# EAGLE design L293D (EAGLE 6.1)
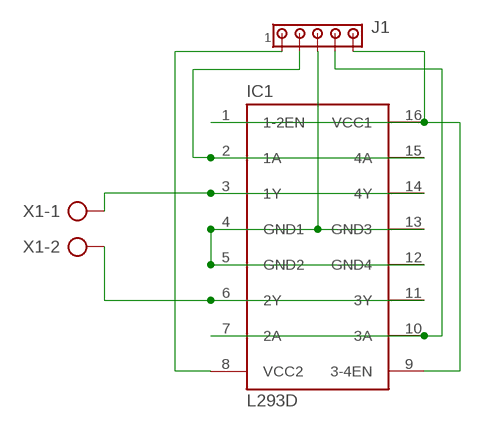
[diagram p0: schematic, sheet 1]

## Parts
IC1  L293D  [DIL16]
J1  MTA05-100  [10X05MTA]
X1  AK300/2  [AK300/2]

## Nets
N$1: IC1.1(1-2EN) IC1.9(3-4EN) IC1.16(VCC1) J1.5
N$2: IC1.2(1A) IC1.15(4A) J1.2
N$3: IC1.3(1Y) IC1.14(4Y) X1.1
N$4: IC1.4(GND1) IC1.5(GND2) IC1.12(GND4) IC1.13(GND3) J1.3
N$6: IC1.6(2Y) IC1.11(3Y) X1.2
N$7: IC1.7(2A) IC1.10(3A) J1.4
N$8: IC1.8(VCC2) J1.1

## Library data of the parts
IC1 = st-microelectronics:L293D: PUSH-PULL 4 CHANNEL DRIVER
J1 = con-amp:MTA05-100: AMP connector
X1 = con-ptr500:AK300/2: CONNECTOR

## Board
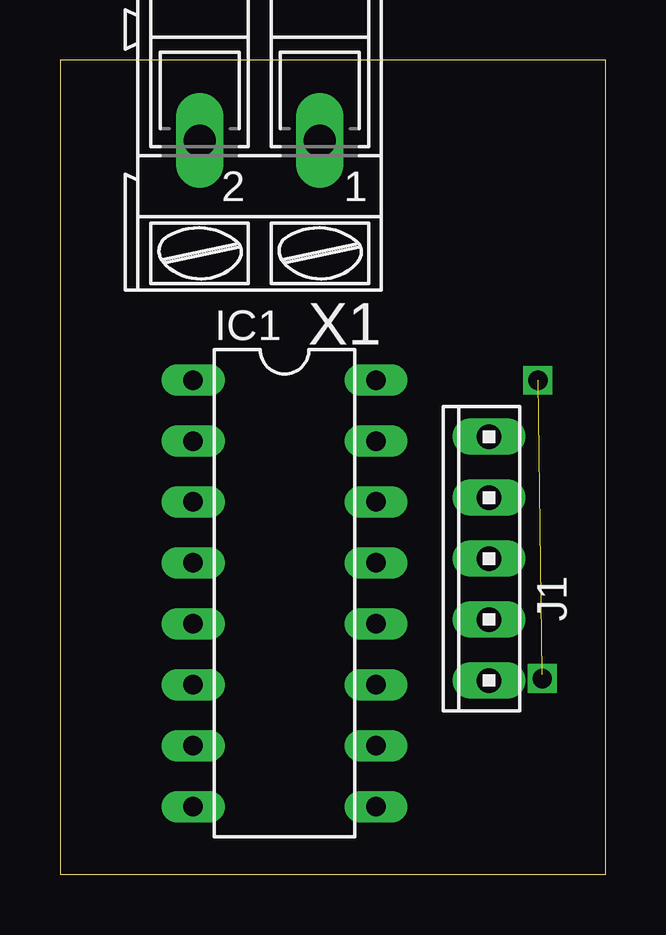
[diagram p1: board, top side]
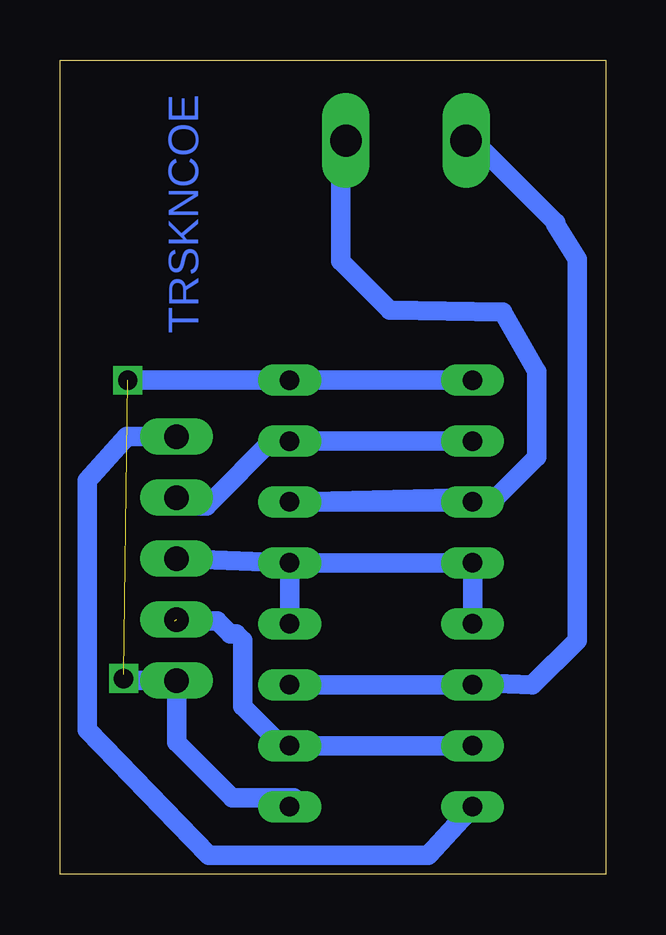
[diagram p2: board, bottom side, seen from below]

Size 22.74 x 33.94 mm. Coordinates in mm from the lower left corner, seen from the top.
Outline: 0,0 22.74,0 22.74,33.94 0,33.94 0,0
Copper layers (1*16): Top 0.035mm / dielectric 1.5mm / Bottom 0.035mm
Design rules: minimum track width 10mil, minimum drill 24mil, track to track 8mil, track to pad 8mil, pad to pad 8mil, via to via 8mil, smd to smd 8mil, copper to edge 40mil, drill to drill 8mil, minimum pad ring 10mil, minimum via ring 8mil, stop-mask expansion 4mil, vias tented up to drill 0mil, thermal gap 10mil

### Footprints (pad centres in the part's own frame; a part is rotated, then mirrored left to right if it is on the bottom)
DIL16 = drill 0.813 long: 1 -8.89,-3.81; 2 -6.35,-3.81; 3 -3.81,-3.81; 4 -1.27,-3.81; 5 1.27,-3.81; 6 3.81,-3.81; 7 6.35,-3.81; 8 8.89,-3.81; 9 8.89,3.81; 10 6.35,3.81; 11 3.81,3.81; 12 1.27,3.81; 13 -1.27,3.81; 14 -3.81,3.81; 15 -6.35,3.81; 16 -8.89,3.81
10X05MTA = drill 1.016 long: 1 5.08,0; 2 2.54,0; 3 0,0; 4 -2.54,0; 5 -5.08,0
AK300/2 = drill 1.321 long: 1 -2.515,0; 2 2.489,0

### Placement (x,y rotation side)
IC1  9.36,11.71 270 top
J1  17.88,13.16 90 top
X1  8.31,30.58 180 top

### Tracks (layer width: path | path; a pad name or v marks a point on that pad's centre or on a via)
N$1  (1 unrouted)
  Bottom 0.813: IC1.1 IC1.16 19.92,20.6 20,20.68 | IC1.9 13,3.18 15.57,3.18 17.88,5.5 J1.5 19.83,8.08 20.09,8.33
N$2
  Bottom 0.813: IC1.2 IC1.15 13.74,18.24 16.63,15.35 17.53,15.35 J1.2
N$3
  Bottom 0.813: IC1.3 IC1.14 5.45,15.7 5.19,15.44 4.84,15.44 2.88,17.39 2.88,20.95 4.3,23.43 9,23.52 11.04,25.56 11.04,31.34 X1.1
N$4
  Bottom 0.813: IC1.13 IC1.4 IC1.5 | IC1.13 IC1.12 | IC1.13 J1.3 | J1.3
N$5  (via drill 0.8)
  other vias: 19.91,20.59
N$6
  Bottom 0.813: IC1.11 IC1.6 5.1,7.98 3.06,7.89 1.2,9.75 1.2,25.65 2.08,27.07 2.08,27.16 5.91,30.99 X1.2
N$7  (1 unrouted)
  Bottom 0.813: IC1.7 IC1.10 13.66,5.54 15.12,7 15.12,9.76 15.39,10.02 15.65,10.02 16.19,10.55 17.96,10.55
N$8
  Bottom 0.813: J1.1 19.95,18.24 21.6,16.41 21.6,6.02 16.54,0.79 7.41,0.79 IC1.8
N$9  (via drill 0.8)
  other vias: 20.09,8.16

### Text on the board
Bottom: TRSKNCOE